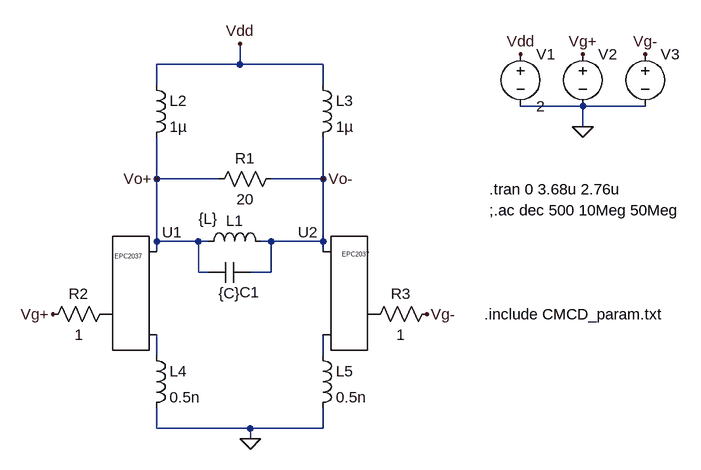
[diagram p0: schematic CMCD.asc]
CMCD.asc, the LTspice schematic file:
Version 4
SHEET 1 1236 680
WIRE 224 -160 224 -192
WIRE 224 -160 96 -160
WIRE 352 -160 224 -160
WIRE 96 -128 96 -160
WIRE 352 -128 352 -160
WIRE 752 -96 656 -96
WIRE 848 -96 752 -96
WIRE 752 -64 752 -96
WIRE 96 16 96 -48
WIRE 192 16 96 16
WIRE 352 16 352 -48
WIRE 352 16 272 16
WIRE 96 112 96 16
WIRE 160 112 96 112
WIRE 176 112 160 112
WIRE 272 112 256 112
WIRE 352 112 352 16
WIRE 352 112 272 112
WIRE 96 128 96 112
WIRE 352 128 352 112
WIRE 160 160 160 112
WIRE 176 160 160 160
WIRE 272 160 272 112
WIRE 272 160 240 160
WIRE 96 288 96 256
WIRE 352 288 352 256
WIRE 96 400 96 368
WIRE 240 400 96 400
WIRE 352 400 352 368
WIRE 352 400 240 400
WIRE 240 416 240 400
FLAG 224 -192 Vdd
FLAG -64 224 Vg+
FLAG 512 224 Vg-
FLAG 752 -64 0
FLAG 656 -176 Vdd
FLAG 752 -176 Vg+
FLAG 848 -176 Vg-
FLAG 96 16 Vo+
FLAG 352 16 Vo-
FLAG 240 416 0
SYMBOL EPCGaN 16 224 R0
WINDOW 3 15 -89 Left 0
SYMATTR Value EPC2037
SYMATTR InstName U1
SYMBOL EPCGaN 432 224 M0
WINDOW 3 8 -92 Left 0
SYMATTR Value EPC2037
SYMATTR InstName U2
SYMBOL ind 160 128 R270
WINDOW 0 32 56 VTop 2
WINDOW 3 66 15 VBottom 2
SYMATTR InstName L1
SYMATTR Value {L}
SYMATTR SpiceLine Rser=0.1
SYMBOL res 288 0 R90
WINDOW 0 0 56 VBottom 2
WINDOW 3 32 56 VTop 2
SYMATTR InstName R1
SYMATTR Value 20
SYMBOL ind 80 -144 R0
SYMATTR InstName L2
SYMATTR Value 1µ
SYMATTR SpiceLine Rser=0.1
SYMBOL ind 336 -144 R0
SYMATTR InstName L3
SYMATTR Value 1µ
SYMATTR SpiceLine Rser=0.1
SYMBOL voltage 656 -192 R0
WINDOW 123 0 0 Left 0
WINDOW 39 0 0 Left 0
SYMATTR InstName V1
SYMATTR Value 2
SYMBOL voltage 848 -192 R0
WINDOW 3 24 96 Invisible 2
SYMATTR Value PULSE(0 5 18.4365n 0.1n 0.1n 18.3n 36.873n)
SYMATTR Value2 AC 1
SYMATTR SpiceLine Rser=20
SYMATTR InstName V3
SYMBOL voltage 752 -192 R0
WINDOW 3 24 96 Invisible 2
SYMATTR Value PULSE(0 5 0 0.1n 0.1n 18.3n 36.873n)
SYMATTR Value2 AC 1
SYMATTR SpiceLine Rser=20
SYMATTR InstName V2
SYMBOL cap 240 144 R90
WINDOW 0 62 1 VBottom 2
WINDOW 3 32 32 VTop 2
SYMATTR InstName C1
SYMATTR Value {C}
SYMBOL res 32 208 R90
WINDOW 0 0 56 VBottom 2
WINDOW 3 32 56 VTop 2
SYMATTR InstName R2
SYMATTR Value 1
SYMBOL res 528 208 R90
WINDOW 0 0 56 VBottom 2
WINDOW 3 32 56 VTop 2
SYMATTR InstName R3
SYMATTR Value 1
SYMBOL ind 80 272 R0
SYMATTR InstName L4
SYMATTR Value 0.5n
SYMBOL ind 336 272 R0
SYMATTR InstName L5
SYMATTR Value 0.5n
TEXT 600 224 Left 2 !.include CMCD_param.txt
TEXT 608 32 Left 2 !.tran 0 3.68u 2.76u
TEXT 608 64 Left 2 !;.ac dec 500 10Meg 50Meg

The netlist it stands for:
* CMCD.asc
XU1 P001 Vo+ N001 EPC2037
XU2 P002 Vo- N002 EPC2037
L1 Vo+ Vo- {L} Rser=0.1
R1 Vo- Vo+ 20
L2 Vdd Vo+ 1µ Rser=0.1
L3 Vdd Vo- 1µ Rser=0.1
V1 Vdd 0 2
V3 Vg- 0 PULSE(0 5 18.4365n 0.1n 0.1n 18.3n 36.873n) AC 1 Rser=20
V2 Vg+ 0 PULSE(0 5 0 0.1n 0.1n 18.3n 36.873n) AC 1 Rser=20
C1 Vo- Vo+ {C}
R2 P001 Vg+ 1
R3 Vg- P002 1
L4 N001 0 0.5n
L5 N002 0 0.5n
.include CMCD_param.txt
.tran 0 3.68u 2.76u
;.ac dec 500 10Meg 50Meg
.backanno
.end

* Results of the author's LTspice run, read from the files saved beside the schematic
* Operating Point, zero values left out:
*   V(vo+) = 2 V
*   V(p001) = 22.11 nV
*   V(vo-) = 2 V
*   V(p002) = 22.11 nV
*   V(vdd) = 2 V
*   V(vg-) = 21.06 nV
*   V(vg+) = 21.06 nV
*   I(L5) = 46.77 nA
*   I(L4) = 46.77 nA
*   I(L3) = 47.83 nA
*   I(L2) = 47.83 nA
*   I(R3) = -1.053 nA
*   I(R2) = 1.053 nA
*   I(V2) = 1.053 nA
*   I(V3) = 1.053 nA
*   I(V1) = -95.65 nA
*   Ix(u1:GATEIN) = -1.053 nA
*   Ix(u1:DRAININ) = 47.83 nA
*   Ix(u1:SOURCEIN) = -46.77 nA
*   Ix(u2:GATEIN) = -1.053 nA
*   Ix(u2:DRAININ) = 47.83 nA
*   Ix(u2:SOURCEIN) = -46.77 nA
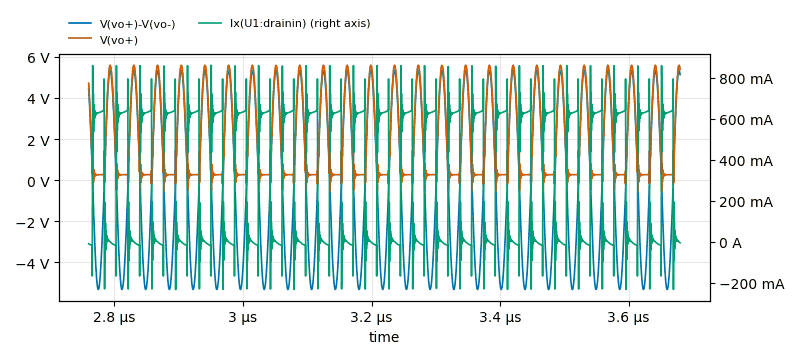
[diagram p1: Transient Analysis of CMCD.asc, plotted from the saved traces]
* Transient Analysis, 1 run:
*   V(vo+)-V(vo-): min -5.339 V, max 5.34 V, average -9.601 mV, rms 3.774 V, last 5.137 V
*   V(vo+): min -513 mV, max 5.598 V, average 1.962 V, rms 2.842 V, last 5.395 V
*   Ix(U1:drainin): min -232.3 mA, max 861.7 mA, average 315.1 mA, rms 447.5 mA, last -4.522 mA
* From the log:
*   N-Period=1
*   Fourier components of I(r1)
*   DC component:8.82833e-005
*   Harmonic  Frequency   Fourier   Normalized   Phase    Normalized
*    Number     [Hz]     Component   Component  [degree]  Phase [deg]
*       1     2.712e+07  2.668e-01  1.000e+00    -58.34°      0.00°
*       2     5.424e+07  2.218e-04  8.314e-04     72.25°    130.59°
*       3     8.136e+07  5.175e-03  1.940e-02     97.36°    155.69°
*       4     1.085e+08  1.684e-04  6.313e-04     35.57°     93.91°
*       5     1.356e+08  1.818e-03  6.812e-03    -13.46°     44.88°
*       6     1.627e+08  1.140e-04  4.274e-04     -3.49°     54.84°
*       7     1.898e+08  8.430e-04  3.159e-03   -125.27°    -66.93°
*       8     2.170e+08  7.005e-05  2.625e-04    -54.50°      3.84°
*       9     2.441e+08  4.861e-04  1.822e-03    116.80°    175.13°
*   Total Harmonic Distortion: 2.091114%(2.102363%)
*   pout: AVG(i(r1)*(v(vo+)-v(vo-)))=-0.711672 FROM 0 TO 9.2e-007
*   pin: AVG(i(v1)*v(vdd))=-1.25783 FROM 0 TO 9.2e-007
*   pgate: AVG(i(v2)*v(vg+) + i(v3)*v(vg-))=-0.00331012 FROM 0 TO 9.2e-007
*   eff: pout/pin=0.565795
*   pae: pout/(pin+pgate)=0.56431